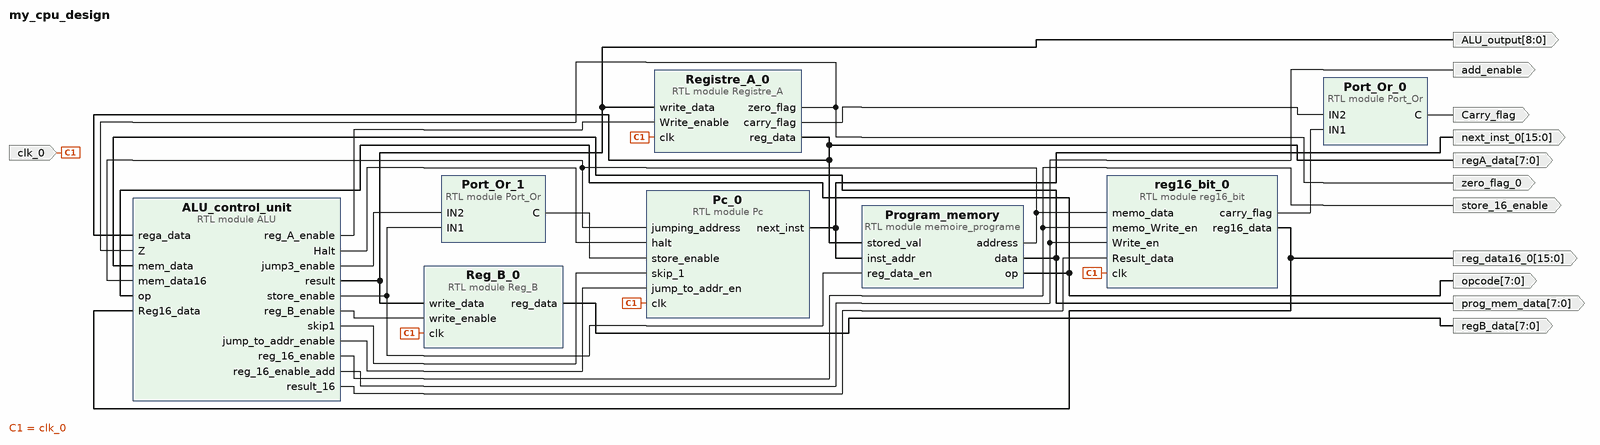
[diagram p0: block diagram of the top level]
# Vivado block design my_cpu_design, xc7a100tcsg324-1, Vivado 2024.2
create_bd_design my_cpu_design

create_bd_port -dir I -type clk clk_0
create_bd_port -dir O -from 15 -to 0 next_inst_0
create_bd_port -dir O -from 8 -to 0 ALU_output
create_bd_port -dir O -from 7 -to 0 regA_data
create_bd_port -dir O -from 7 -to 0 prog_mem_data
create_bd_port -dir O -from 7 -to 0 opcode
create_bd_port -dir O -from 7 -to 0 regB_data
create_bd_port -dir O -from 15 -to 0 reg_data16_0
create_bd_port -dir O add_enable
create_bd_port -dir O store_16_enable
create_bd_port -dir O Carry_flag
create_bd_port -dir O zero_flag_0

create_bd_cell -type module -reference Pc Pc_0
create_bd_cell -type module -reference memoire_programe Program_memory
create_bd_cell -type module -reference ALU ALU_control_unit
create_bd_cell -type module -reference Registre_A Registre_A_0
create_bd_cell -type module -reference Reg_B Reg_B_0
create_bd_cell -type module -reference reg16_bit reg16_bit_0
create_bd_cell -type module -reference Port_Or Port_Or_0
create_bd_cell -type module -reference Port_Or Port_Or_1

# ---- connections ----

connect_bd_net -net ALU_0_Halt [get_bd_pins ALU_control_unit/Halt] [get_bd_pins Pc_0/halt]
connect_bd_net -net ALU_0_jump1 [get_bd_pins ALU_control_unit/skip1] [get_bd_pins Pc_0/skip_1]
connect_bd_net -net ALU_0_jump_enable [get_bd_pins ALU_control_unit/jump_to_addr_enable] [get_bd_pins Pc_0/jump_to_addr_en]
connect_bd_net -net ALU_0_reg_16_enable [get_bd_pins ALU_control_unit/reg_16_enable] \
  [get_bd_ports store_16_enable] [get_bd_pins reg16_bit_0/memo_Write_en]
connect_bd_net -net ALU_0_reg_16_enable_add [get_bd_pins ALU_control_unit/reg_16_enable_add] \
  [get_bd_ports add_enable] [get_bd_pins reg16_bit_0/Write_en]
connect_bd_net -net ALU_0_reg_A_enable [get_bd_pins ALU_control_unit/reg_A_enable] [get_bd_pins Registre_A_0/Write_enable]
connect_bd_net -net ALU_0_reg_B_enable [get_bd_pins ALU_control_unit/reg_B_enable] [get_bd_pins Reg_B_0/write_enable]
connect_bd_net -net ALU_0_result [get_bd_pins ALU_control_unit/result] \
  [get_bd_ports ALU_output] [get_bd_pins Reg_B_0/write_data] [get_bd_pins Registre_A_0/write_data]
connect_bd_net -net ALU_0_result_16 [get_bd_pins ALU_control_unit/result_16] [get_bd_pins reg16_bit_0/Result_data]
connect_bd_net [get_bd_pins ALU_control_unit/jump3_enable] [get_bd_pins Port_Or_1/IN2]
connect_bd_net [get_bd_pins ALU_control_unit/store_enable] [get_bd_pins Port_Or_1/IN1] [get_bd_pins Program_memory/reg_data_en]
connect_bd_net [get_bd_pins Pc_0/next_inst] [get_bd_ports next_inst_0] [get_bd_pins Program_memory/inst_addr]
connect_bd_net [get_bd_pins Port_Or_0/C] [get_bd_ports Carry_flag]
connect_bd_net [get_bd_pins Port_Or_1/C] [get_bd_pins Pc_0/store_enable]
connect_bd_net [get_bd_pins Reg_B_0/reg_data] [get_bd_ports regB_data]
connect_bd_net [get_bd_pins Registre_A_0/carry_flag] [get_bd_pins Port_Or_0/IN2]
connect_bd_net [get_bd_pins Registre_A_0/reg_data] \
  [get_bd_ports regA_data] [get_bd_pins ALU_control_unit/rega_data] [get_bd_pins Program_memory/stored_val]
connect_bd_net [get_bd_pins Registre_A_0/zero_flag] [get_bd_ports zero_flag_0] [get_bd_pins ALU_control_unit/Z]
connect_bd_net -net clk_0_1 [get_bd_ports clk_0] \
  [get_bd_pins Pc_0/clk] [get_bd_pins reg16_bit_0/clk] [get_bd_pins Reg_B_0/clk] [get_bd_pins Registre_A_0/clk]
connect_bd_net -net memoire_programe_0_address [get_bd_pins Program_memory/address] \
  [get_bd_pins Pc_0/jumping_address] [get_bd_pins reg16_bit_0/memo_data] [get_bd_pins ALU_control_unit/mem_data16]
connect_bd_net -net memoire_programe_0_data [get_bd_pins Program_memory/data] [get_bd_ports prog_mem_data] [get_bd_pins ALU_control_unit/mem_data]
connect_bd_net -net memoire_programe_0_op [get_bd_pins Program_memory/op] [get_bd_ports opcode] [get_bd_pins ALU_control_unit/op]
connect_bd_net [get_bd_pins reg16_bit_0/carry_flag] [get_bd_pins Port_Or_0/IN1]
connect_bd_net -net reg16_bit_0_reg_data [get_bd_pins reg16_bit_0/reg16_data] [get_bd_ports reg_data16_0] [get_bd_pins ALU_control_unit/Reg16_data]

validate_bd_design
save_bd_design
